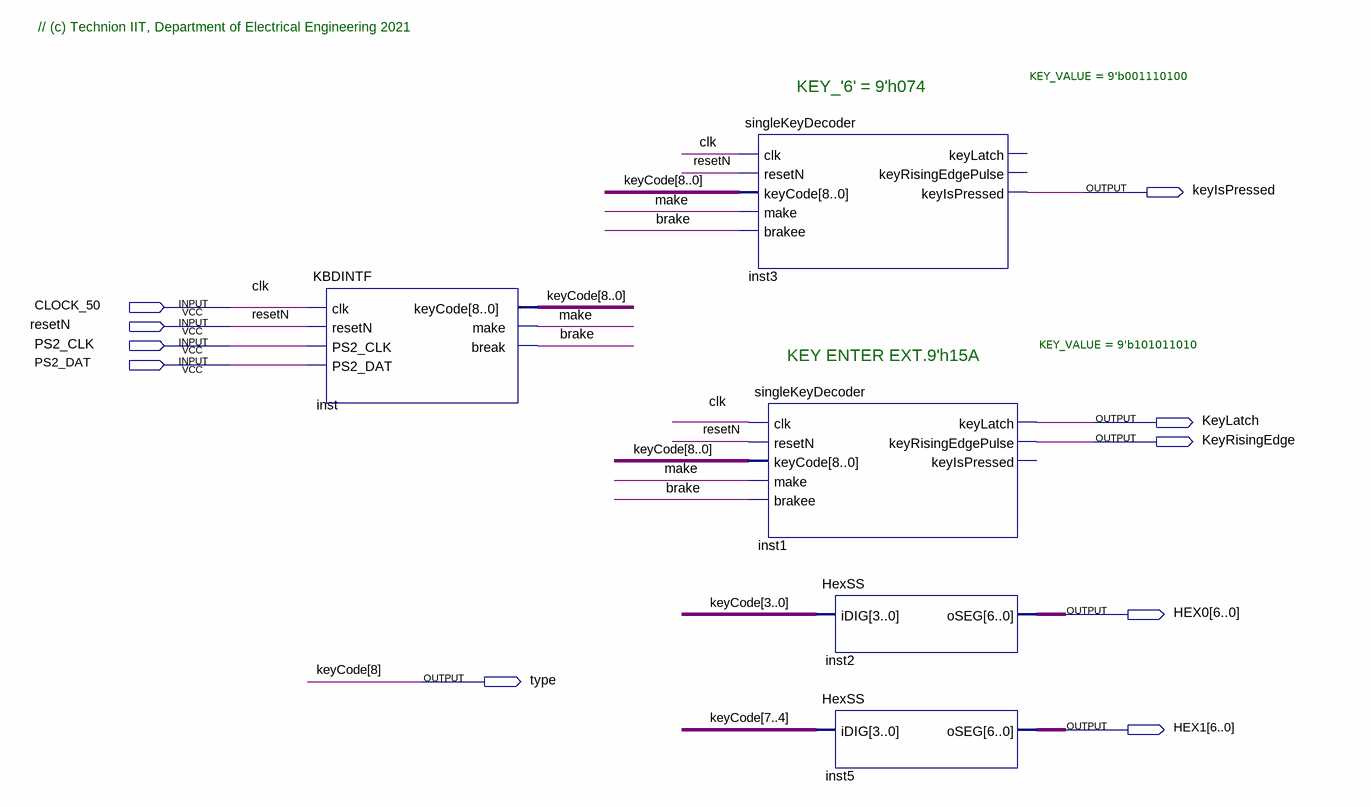
[diagram p0: schematic sheet]
// Quartus schematic KEYBOARD_DECODER.bdf as structural Verilog: 5 symbols, 10 pins
module KEYBOARD_DECODER (
  input  CLOCK_50,
  input  resetN,
  input  PS2_CLK,
  input  PS2_DAT,
  output keyIsPressed,
  output KeyLatch,
  output KeyRisingEdge,
  output [6:0] HEX0,
  output \type ,
  output [6:0] HEX1
);

  wire brake, make;
  wire [7:0] keyCode;

  KBDINTF inst (
    .clk(CLOCK_50), .resetN(resetN), .PS2_CLK(PS2_CLK), .PS2_DAT(PS2_DAT), .keyCode({\type , keyCode}),
    .make(make), .\break (brake));
  singleKeyDecoder #(.KEY_VALUE(9'b001110100)) inst3 (
    .clk(CLOCK_50), .resetN(resetN), .keyCode({\type , keyCode}), .make(make), .brakee(brake),
    .keyIsPressed(keyIsPressed));  // open: keyLatch, keyRisingEdgePulse
  singleKeyDecoder #(.KEY_VALUE(9'b101011010)) inst1 (
    .clk(CLOCK_50), .resetN(resetN), .keyCode({\type , keyCode}), .make(make), .brakee(brake),
    .keyLatch(KeyLatch), .keyRisingEdgePulse(KeyRisingEdge));  // open: keyIsPressed
  HexSS inst2 (.iDIG(keyCode[3:0]), .oSEG(HEX0));
  HexSS inst5 (.iDIG(keyCode[7:4]), .oSEG(HEX1));

  // Other names for the same wires on the sheet: clk = CLOCK_50; keyCode[8] = \type 

  // Notes on the sheet:
  //   // (c) Technion IIT, Department of Electrical Engineering 2021 
  //   KEY_'6' = 9'h074
  //   KEY ENTER EXT.9'h15A
endmodule
